# EasyEDA schematic table3.json
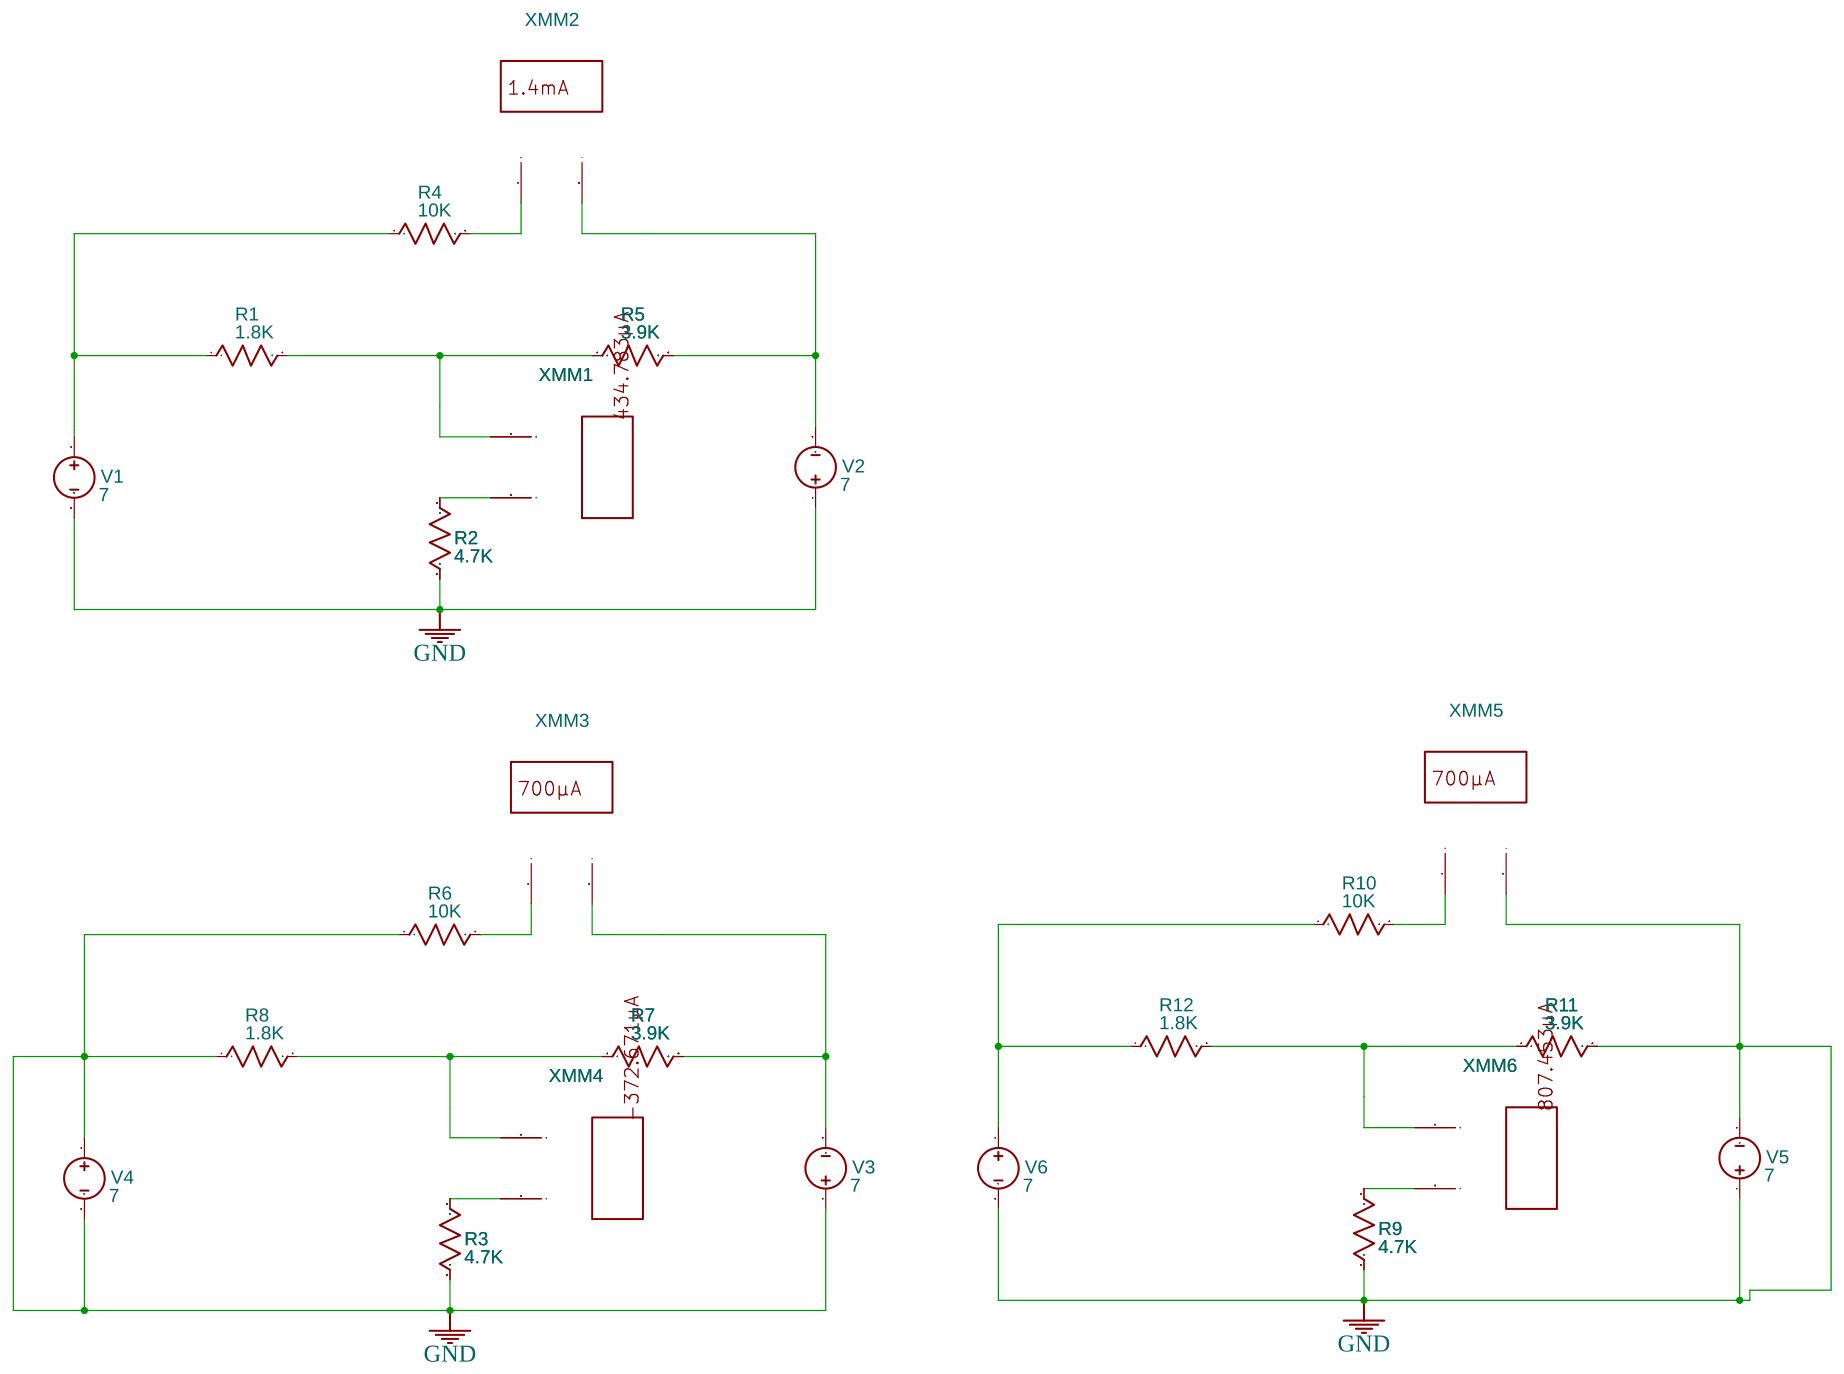
[diagram p0: schematic sheet]

## Parts
R1  1.8K  [AXIAL-0.3]
R2  4.7K  [AXIAL-0.3]
R3  4.7K  [AXIAL-0.3]
R4  10K  [AXIAL-0.3]
R5  3.9K  [AXIAL-0.3]
R6  10K  [AXIAL-0.3]
R7  3.9K  [AXIAL-0.3]
R8  1.8K  [AXIAL-0.3]
R9  4.7K  [AXIAL-0.3]
R10  10K  [AXIAL-0.3]
R11  3.9K  [AXIAL-0.3]
R12  1.8K  [AXIAL-0.3]
V1  7  [HDR1X2]
V2  7  [HDR1X2]
V3  7  [HDR1X2]
V4  7  [HDR1X2]
V5  7  [HDR1X2]
V6  7  [HDR1X2]
XMM1  Multimeter
XMM2  Multimeter
XMM3  Multimeter
XMM4  Multimeter
XMM5  Multimeter
XMM6  Multimeter

## Library data of the parts
R1-R12 = Resistor_US: Resistance: 1k; Contributor: EasyEDA; Supplier: YUJING
V1-V6 = VDC: Contributor: EasyEDA; sim: true
XMM1-XMM6 = MULTIMETER: Supplier: LCSC; Multimeter Type: Amper; Power Type: AC; Voltmeter resistance: 10μ; Ammeter resistance: 1G; NameDisplay: 0; Contributor: EasyEDA; sim: true

## Nets
GND: R2.1 R3.1 R6.1 R8.1 R9.1 R11.2 V1.2 V2.1 V3.1 V4.1 V4.2 V5.1 V5.2 V6.2 XMM5.2(I)
Net-(R1-1): R1.1 R4.1 V1.1
Net-(R1-2): R1.2 R5.1 XMM1.1(+)
Net-(R2-2): R2.2 XMM1.2(I)
Net-(R3-2): R3.2 XMM4.2(I)
Net-(R4-2): R4.2 XMM2.1(+)
Net-(R5-2): R5.2 V2.2 XMM2.2(I)
Net-(R6-2): R6.2 XMM3.1(+)
Net-(R7-1): R7.1 R8.2 XMM4.1(+)
Net-(R7-2): R7.2 V3.2 XMM3.2(I)
Net-(R9-2): R9.2 XMM6.2(I)
Net-(R10-1): R10.1 R12.1 V6.1
Net-(R10-2): R10.2 XMM5.1(+)
Net-(R11-1): R11.1 R12.2 XMM6.1(+)
